# EAGLE schematic main (EAGLE 8.5.2)
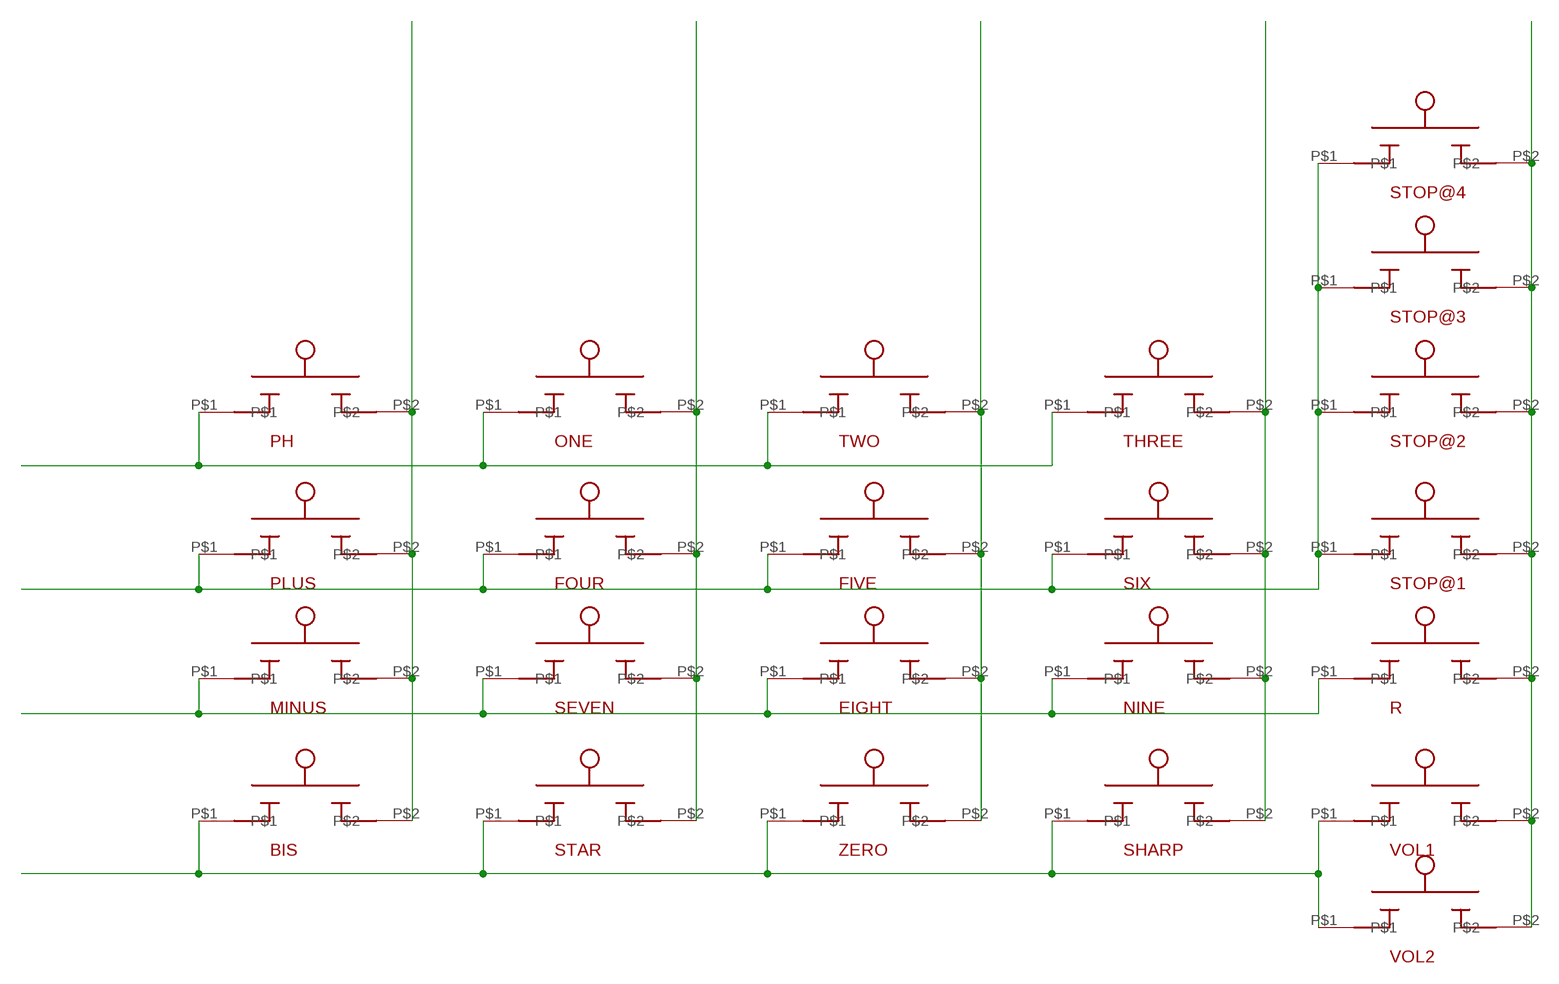
[diagram p0: schematic, sheet 1]

## Parts
BIS  MEMBRANE_BUTTON  [MEMBRANE_BUTTON]
EIGHT  MEMBRANE_BUTTON  [MEMBRANE_BUTTON]
FIVE  MEMBRANE_BUTTON  [MEMBRANE_BUTTON]
FOUR  MEMBRANE_BUTTON  [MEMBRANE_BUTTON]
MINUS  MEMBRANE_BUTTON  [MEMBRANE_BUTTON]
NINE  MEMBRANE_BUTTON  [MEMBRANE_BUTTON]
ONE  MEMBRANE_BUTTON  [MEMBRANE_BUTTON]
PH  MEMBRANE_BUTTON  [MEMBRANE_BUTTON]
PLUS  MEMBRANE_BUTTON  [MEMBRANE_BUTTON]
R  MEMBRANE_BUTTON  [MEMBRANE_BUTTON]
SEVEN  MEMBRANE_BUTTON  [MEMBRANE_BUTTON]
SHARP  MEMBRANE_BUTTON  [MEMBRANE_BUTTON]
SIX  MEMBRANE_BUTTON  [MEMBRANE_BUTTON]
STAR  MEMBRANE_BUTTON  [MEMBRANE_BUTTON]
STOP@1  MEMBRANE_BUTTON  [MEMBRANE_BUTTON]
STOP@2  MEMBRANE_BUTTON  [MEMBRANE_BUTTON]
STOP@3  MEMBRANE_BUTTON  [MEMBRANE_BUTTON]
STOP@4  MEMBRANE_BUTTON  [MEMBRANE_BUTTON]
THREE  MEMBRANE_BUTTON  [MEMBRANE_BUTTON]
TWO  MEMBRANE_BUTTON  [MEMBRANE_BUTTON]
VOL1  MEMBRANE_BUTTON  [MEMBRANE_BUTTON]
VOL2  MEMBRANE_BUTTON  [MEMBRANE_BUTTON]
ZERO  MEMBRANE_BUTTON  [MEMBRANE_BUTTON]

## Nets
N$1: ONE.P$1 PH.P$1 THREE.P$1 TWO.P$1
N$2: FIVE.P$1 FOUR.P$1 PLUS.P$1 SIX.P$1 STOP@1.P$1 STOP@2.P$1 STOP@3.P$1 STOP@4.P$1
N$3: EIGHT.P$1 MINUS.P$1 NINE.P$1 R.P$1 SEVEN.P$1
N$4: BIS.P$2 MINUS.P$2 PH.P$2 PLUS.P$2
N$5: FOUR.P$2 ONE.P$2 SEVEN.P$2 STAR.P$2
N$6: EIGHT.P$2 FIVE.P$2 TWO.P$2 ZERO.P$2
N$7: NINE.P$2 SHARP.P$2 SIX.P$2 THREE.P$2
N$8: R.P$2 STOP@1.P$2 STOP@2.P$2 STOP@3.P$2 STOP@4.P$2 VOL1.P$2 VOL2.P$2
N$9: BIS.P$1 SHARP.P$1 STAR.P$1 VOL1.P$1 VOL2.P$1 ZERO.P$1

## Library data of the parts
BIS EIGHT FIVE FOUR MINUS NINE ONE PH PLUS R SEVEN SHARP SIX STAR STOP@1-STOP@4 THREE TWO VOL1 VOL2 ZERO = 7_segment_lib:MEMBRANE_BUTTON